# EAGLE design M4-RF (EAGLE 6.5.0)

## Sheet 1 of 4: 900MHz Radio
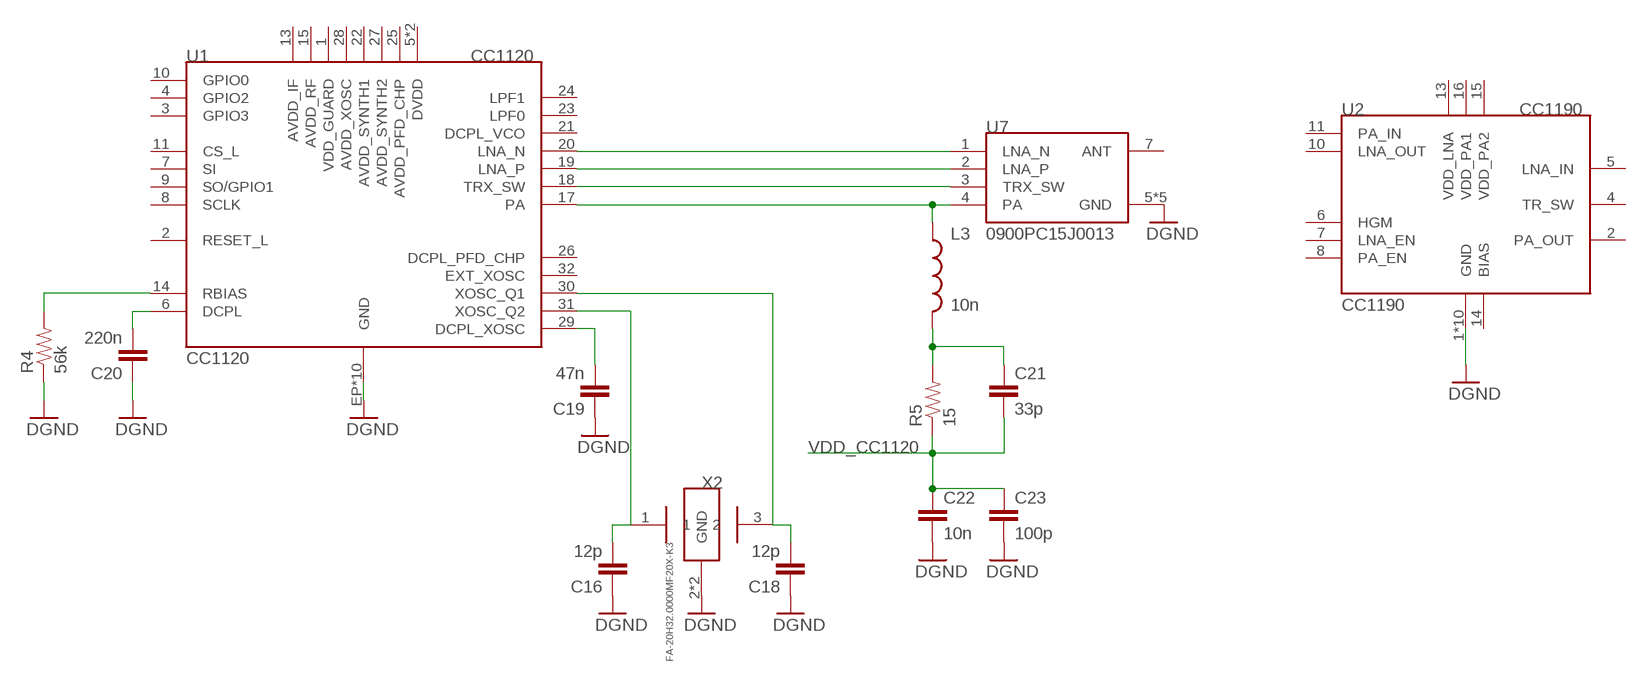
[diagram p0: schematic, sheet 1]

### Parts
C16  12p  CAP0402-CAP  [0402-CAP]
C18  12p  CAP0402-CAP  [0402-CAP]
C19  47n  CAP0402-CAP  [0402-CAP]
C20  220n  CAP0402-CAP  [0402-CAP]
C21  33p  CAP0402-CAP  [0402-CAP]
C22  10n  CAP0402-CAP  [0402-CAP]
C23  100p  CAP0402-CAP  [0402-CAP]
L3  10n  INDUCTOR0402  [C0402]
R4  56k  RESISTOR0402-RES  [0402-RES]
R5  15  RESISTOR0402-RES  [0402-RES]
U1  CC1120  [RHB_S-PVQFN-N32]
U2  CC1190  [RGV_S-PVQFN-N16]
U7  0900PC15J0013  [0900PC15J0013]
X2  FA-20H32.0000MF20X-K3  [FA-20H]

### Nets
GND: C16.1 C18.1 C19.1 C20.1 C22.2 C23.2 R4.1 U1.EP(GND) U1.EXP@1(GND) U1.EXP@2(GND) U1.EXP@3(GND) U1.EXP@4(GND) U1.EXP@5(GND) U1.EXP@6(GND) U1.EXP@7(GND) U1.EXP@8(GND) U1.EXP@9(GND) U2.1(GND) U2.3(GND) U2.9(GND) U2.12(GND) U2.EP(GND) U2.EP@1(GND) U2.EP@2(GND) U2.EP@3(GND) U2.EP@4(GND) U2.EP@5(GND) U7.5(GND) U7.6(GND) U7.8(GND) U7.9(GND) U7.10(GND) X2.2(GND) X2.4(GND) ; supply symbol labelled DGND ; also sheet 2
N$24: C16.2 U1.31(XOSC_Q2) X2.1
N$25: C18.2 U1.30(XOSC_Q1) X2.3
N$26: C19.2 U1.29(DCPL_XOSC)
N$27: C20.2 U1.6(DCPL)
N$28: R4.2 U1.14(RBIAS)
N$29: U1.20(LNA_N) U7.1(LNA_N)
N$30: U1.19(LNA_P) U7.2(LNA_P)
N$31: U1.18(TRX_SW) U7.3(TRX_SW)
N$32: L3.1 U1.17(PA) U7.4(PA)
N$33: C21.1 L3.2 R5.2
VDD_CC1120: C21.2 C22.1 C23.1 R5.1
Unconnected: U1.1(VDD_GUARD) U1.2(RESET_L) U1.3(GPIO3) U1.4(GPIO2) U1.5(DVDD) U1.7(SI) U1.8(SCLK) U1.9(SO/GPIO1) U1.10(GPIO0) U1.11(CS_L) U1.12(DVDD) U1.13(AVDD_IF) U1.15(AVDD_RF) U1.21(DCPL_VCO) U1.22(AVDD_SYNTH1) U1.23(LPF0) U1.24(LPF1) U1.25(AVDD_PFD_CHP) U1.26(DCPL_PFD_CHP) U1.27(AVDD_SYNTH2) U1.28(AVDD_XOSC) U1.32(EXT_XOSC) U2.2(PA_OUT) U2.4(TR_SW) U2.5(LNA_IN) U2.6(HGM) U2.7(LNA_EN) U2.8(PA_EN) U2.10(LNA_OUT) U2.11(PA_IN) U2.13(VDD_LNA) U2.14(BIAS) U2.15(VDD_PA2) U2.16(VDD_PA1) U7.7(ANT)

## Sheet 2 of 4: 2.4GHz Radio
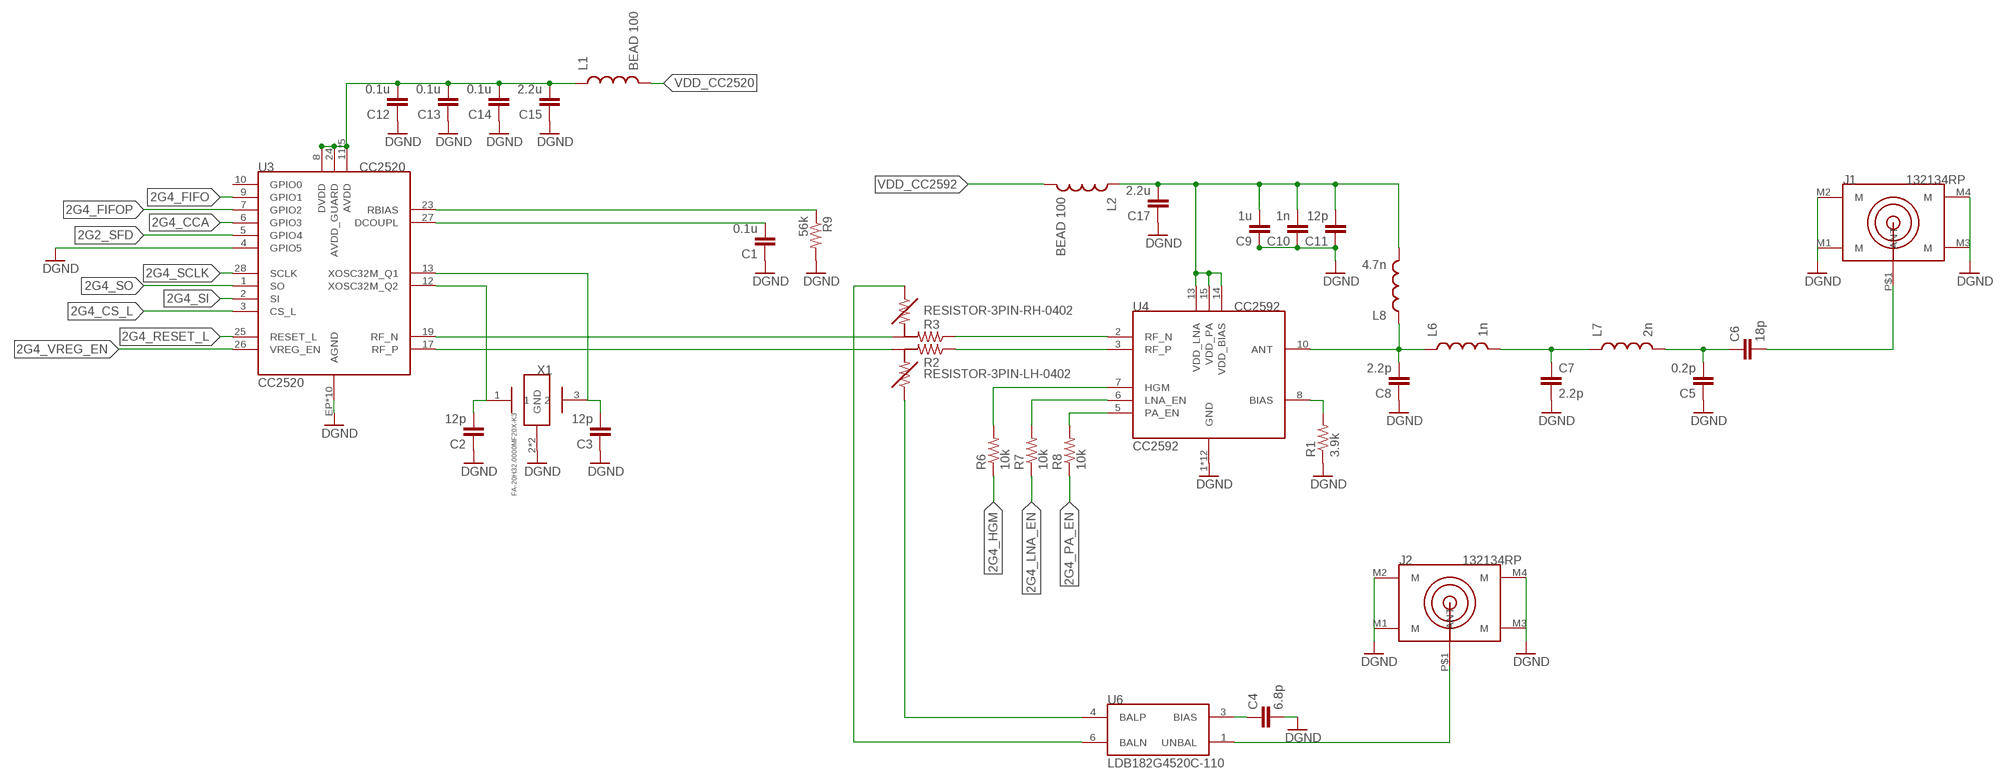
[diagram p1: schematic, sheet 2]

### Parts
C1  0.1u  CAP0402-CAP  [0402-CAP]
C2  12p  CAP0402-CAP  [0402-CAP]
C3  12p  CAP0402-CAP  [0402-CAP]
C4  6.8p  CAP0402-CAP  [0402-CAP]
C5  0.2p  CAP0402-CAP  [0402-CAP]
C6  18p  CAP0402-CAP  [0402-CAP]
C7  2.2p  CAP0402-CAP  [0402-CAP]
C8  2.2p  CAP0402-CAP  [0402-CAP]
C9  1u  CAP0402-CAP  [0402-CAP]
C10  1n  CAP0402-CAP  [0402-CAP]
C11  12p  CAP0402-CAP  [0402-CAP]
C12  0.1u  CAP0402-CAP  [0402-CAP]
C13  0.1u  CAP0402-CAP  [0402-CAP]
C14  0.1u  CAP0402-CAP  [0402-CAP]
C15  2.2u  CAP0402-CAP  [0402-CAP]
C17  2.2u  CAP0402-CAP  [0402-CAP]
J1  132134RP  [RP-SMA-TH]
J2  132134RP  [RP-SMA-TH]
L1  BEAD 100  INDUCTOR0402  [C0402]
L2  BEAD 100  INDUCTOR0402  [C0402]
L6  1n  INDUCTOR0402  [C0402]
L7  2n  INDUCTOR0402  [C0402]
L8  4.7n  INDUCTOR0402  [C0402]
R1  3.9k  RESISTOR0402-RES  [0402-RES]
R2  RESISTOR-3PIN-LH-0402  [0402-RES-3PIN-LH]
R3  RESISTOR-3PIN-RH-0402  [0402-RES-3PIN-RH]
R6  10k  RESISTOR0402-RES  [0402-RES]
R7  10k  RESISTOR0402-RES  [0402-RES]
R8  10k  RESISTOR0402-RES  [0402-RES]
R9  56k  RESISTOR0402-RES  [0402-RES]
U3  CC2520  [RHD_S-PVQFN-N28]
U4  CC2592  [RGV_S-PVQFN-N16]
U6  LDB182G4520C-110  [LDB18]
X1  FA-20H32.0000MF20X-K3  [FA-20H]

### Nets
2G2_SFD: U3.5(GPIO4)
2G4_CCA: U3.6(GPIO3)
2G4_CS_L: U3.3(CS_L)
2G4_FIFO: U3.9(GPIO1)
2G4_FIFOP: U3.7(GPIO2)
2G4_HGM: R6.1
2G4_LG [50 ohm]: C6.2 J1.P$1(ANT)
2G4_LNA_EN: R7.1
2G4_LP [50 ohm]: J2.P$1(ANT) U6.1(UNBAL)
2G4_PA_EN: R8.1
2G4_RESET_L: U3.25(RESET_L)
2G4_SCLK: U3.28(SCLK)
2G4_SI: U3.2(SI)
2G4_SO: U3.1(SO)
2G4_VREG_EN: U3.26(VREG_EN)
GND: C1.1 C2.1 C3.1 C4.2 C5.1 C7.2 C8.1 C9.1 C10.1 C11.1 C12.1 C13.1 C14.1 C15.1 C17.1 J1.M1(M) J1.M2(M) J1.M3(M) J1.M4(M) J2.M1(M) J2.M2(M) J2.M3(M) J2.M4(M) R1.1 R9.2 U3.4(GPIO5) U3.EP(AGND) U3.EXP@1(AGND) U3.EXP@2(AGND) U3.EXP@3(AGND) U3.EXP@4(AGND) U3.EXP@5(AGND) U3.EXP@6(AGND) U3.EXP@7(AGND) U3.EXP@8(AGND) U3.EXP@9(AGND) U4.1(GND) U4.4(GND) U4.9(GND) U4.11(GND) U4.12(GND) U4.16(GND) U4.EP(GND) U4.EP@1(GND) U4.EP@2(GND) U4.EP@3(GND) U4.EP@4(GND) U4.EP@5(GND) X1.2(GND) X1.4(GND) ; supply symbol labelled DGND ; also sheet 1
N$1 [50 ohm]: R3.2 U3.19(RF_N)
N$2 [50 ohm]: R2.2 U3.17(RF_P)
N$3: R6.2 U4.7(HGM)
N$5: R7.2 U4.6(LNA_EN)
N$6 [50 ohm]: R2.1 U4.3(RF_P)
N$7 [50 ohm]: C8.2 L6.1 L8.1 U4.10(ANT)
N$8 [50 ohm]: C7.1 L6.2 L7.1
N$9 [50 ohm]: C5.2 C6.1 L7.2
N$10: C9.2 C10.2 C11.2 C17.2 L2.1 L8.2 U4.13(VDD_LNA) U4.14(VDD_BIAS) U4.15(VDD_PA)
N$11: R1.2 U4.8(BIAS)
N$12 [50 ohm]: R3.1 U4.2(RF_N)
N$13: R8.2 U4.5(PA_EN)
N$14: C12.2 C13.2 C14.2 C15.2 L1.1 U3.8(DVDD) U3.11(AVDD) U3.14(AVDD) U3.16(AVDD) U3.20(AVDD) U3.22(AVDD) U3.24(AVDD_GUARD)
N$15: C2.2 U3.12(XOSC32M_Q2) X1.1
N$16: R9.1 U3.23(RBIAS)
N$17: C1.2 U3.27(DCOUPL)
N$18: C3.2 U3.13(XOSC32M_Q1) X1.3
N$19 [50 ohm]: R2.3 U6.4(BALP)
N$20 [50 ohm]: R3.3 U6.6(BALN)
N$22: C4.1 U6.3(BIAS)
VDD_CC2520: L1.2
VDD_CC2592: L2.2
Unconnected: U3.10(GPIO0)

## Sheet 3 of 4: MCU
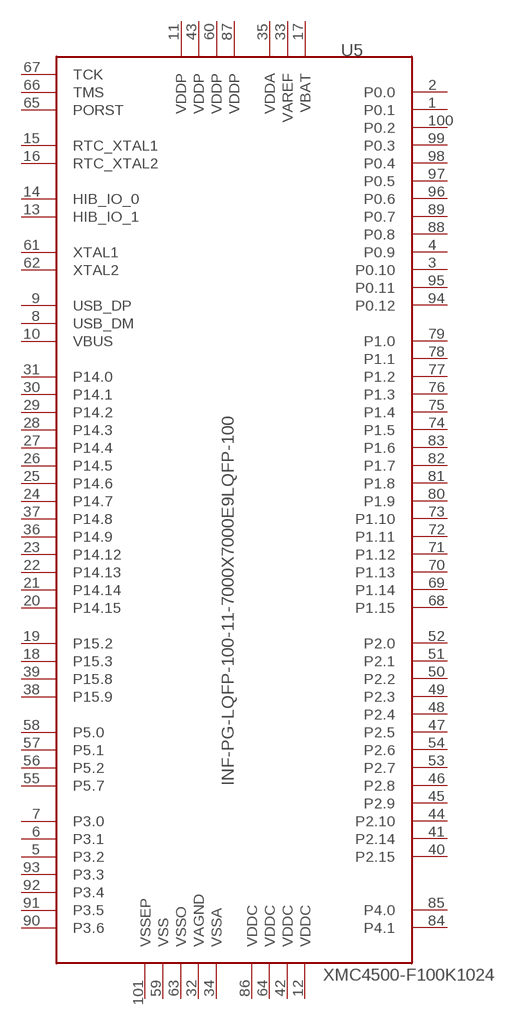
[diagram p2: schematic, sheet 3]

### Parts
U5  INF-PG-LQFP-100-11-7000X7000E9LQFP-100  [INF-PG-LQFP-100-11-7000X7000E9PRIMARY]
Unconnected: U5.1(P0.1) U5.2(P0.0) U5.3(P0.10) U5.4(P0.9) U5.5(P3.2) U5.6(P3.1) U5.7(P3.0) U5.8(USB_DM) U5.9(USB_DP) U5.10(VBUS) U5.11(VDDP) U5.12(VDDC) U5.13(HIB_IO_1) U5.14(HIB_IO_0) U5.15(RTC_XTAL1) U5.16(RTC_XTAL2) U5.17(VBAT) U5.18(P15.3) U5.19(P15.2) U5.20(P14.15) U5.21(P14.14) U5.22(P14.13) U5.23(P14.12) U5.24(P14.7) U5.25(P14.6) U5.26(P14.5) U5.27(P14.4) U5.28(P14.3) U5.29(P14.2) U5.30(P14.1) U5.31(P14.0) U5.32(VAGND) U5.33(VAREF) U5.34(VSSA) U5.35(VDDA) U5.36(P14.9) U5.37(P14.8) U5.38(P15.9) U5.39(P15.8) U5.40(P2.15) U5.41(P2.14) U5.42(VDDC) U5.43(VDDP) U5.44(P2.10) U5.45(P2.9) U5.46(P2.8) U5.47(P2.5) U5.48(P2.4) U5.49(P2.3) U5.50(P2.2) U5.51(P2.1) U5.52(P2.0) U5.53(P2.7) U5.54(P2.6) U5.55(P5.7) U5.56(P5.2) U5.57(P5.1) U5.58(P5.0) U5.59(VSS) U5.60(VDDP) U5.61(XTAL1) U5.62(XTAL2) U5.63(VSSO) U5.64(VDDC) U5.65(PORST) U5.66(TMS) U5.67(TCK) U5.68(P1.15) U5.69(P1.14) U5.70(P1.13) U5.71(P1.12) U5.72(P1.11) U5.73(P1.10) U5.74(P1.5) U5.75(P1.4) U5.76(P1.3) U5.77(P1.2) U5.78(P1.1) U5.79(P1.0) U5.80(P1.9) U5.81(P1.8) U5.82(P1.7) U5.83(P1.6) U5.84(P4.1) U5.85(P4.0) U5.86(VDDC) U5.87(VDDP) U5.88(P0.8) U5.89(P0.7) U5.90(P3.6) U5.91(P3.5) U5.92(P3.4) U5.93(P3.3) U5.94(P0.12) U5.95(P0.11) U5.96(P0.6) U5.97(P0.5) U5.98(P0.4) U5.99(P0.3) U5.100(P0.2) U5.101(VSSEP)

## Sheet 4 of 4: USB Interface

## Library data of the parts
C1-C20 = SparkFun-Capacitors:CAP: Capacitor Standard 0603 ceramic capacitor, and 0.1" leaded capacitor.
C21-C23 = SparkFun-Passives:CAP: Capacitor Standard 0603 ceramic capacitor, and 0.1" leaded capacitor.
J1 J2 = connectors:132134RP
L1-L3 L6-L8 = SparkFun-Passives:INDUCTOR: Inductors Basic Inductor/Choke - 0603 and 1206. Footprints are not proven and vary greatly between part numbers.
R1 R4-R9 = SparkFun-Resistors:RESISTOR: Resistor Basic schematic elements and footprints for 0603, 1206, and PTH resistors.
R2 = SparkFun-Resistors:RESISTOR-3PIN-LH
R3 = SparkFun-Resistors:RESISTOR-3PIN-RH
U1 = rf:CC1120
U2 = rf:CC1190
U3 = rf:CC2520
U4 = rf:CC2592
U5 = XMC4500-F100K1024 AB:INF-PG-LQFP-100-11-7000X7000E9
U6 = rf:LDB18
U7 = rf:0900PC15J0013
X1 X2 = oscillators:FA-20H

## Net classes
1 50 ohm: width 0.305 mm

## Board
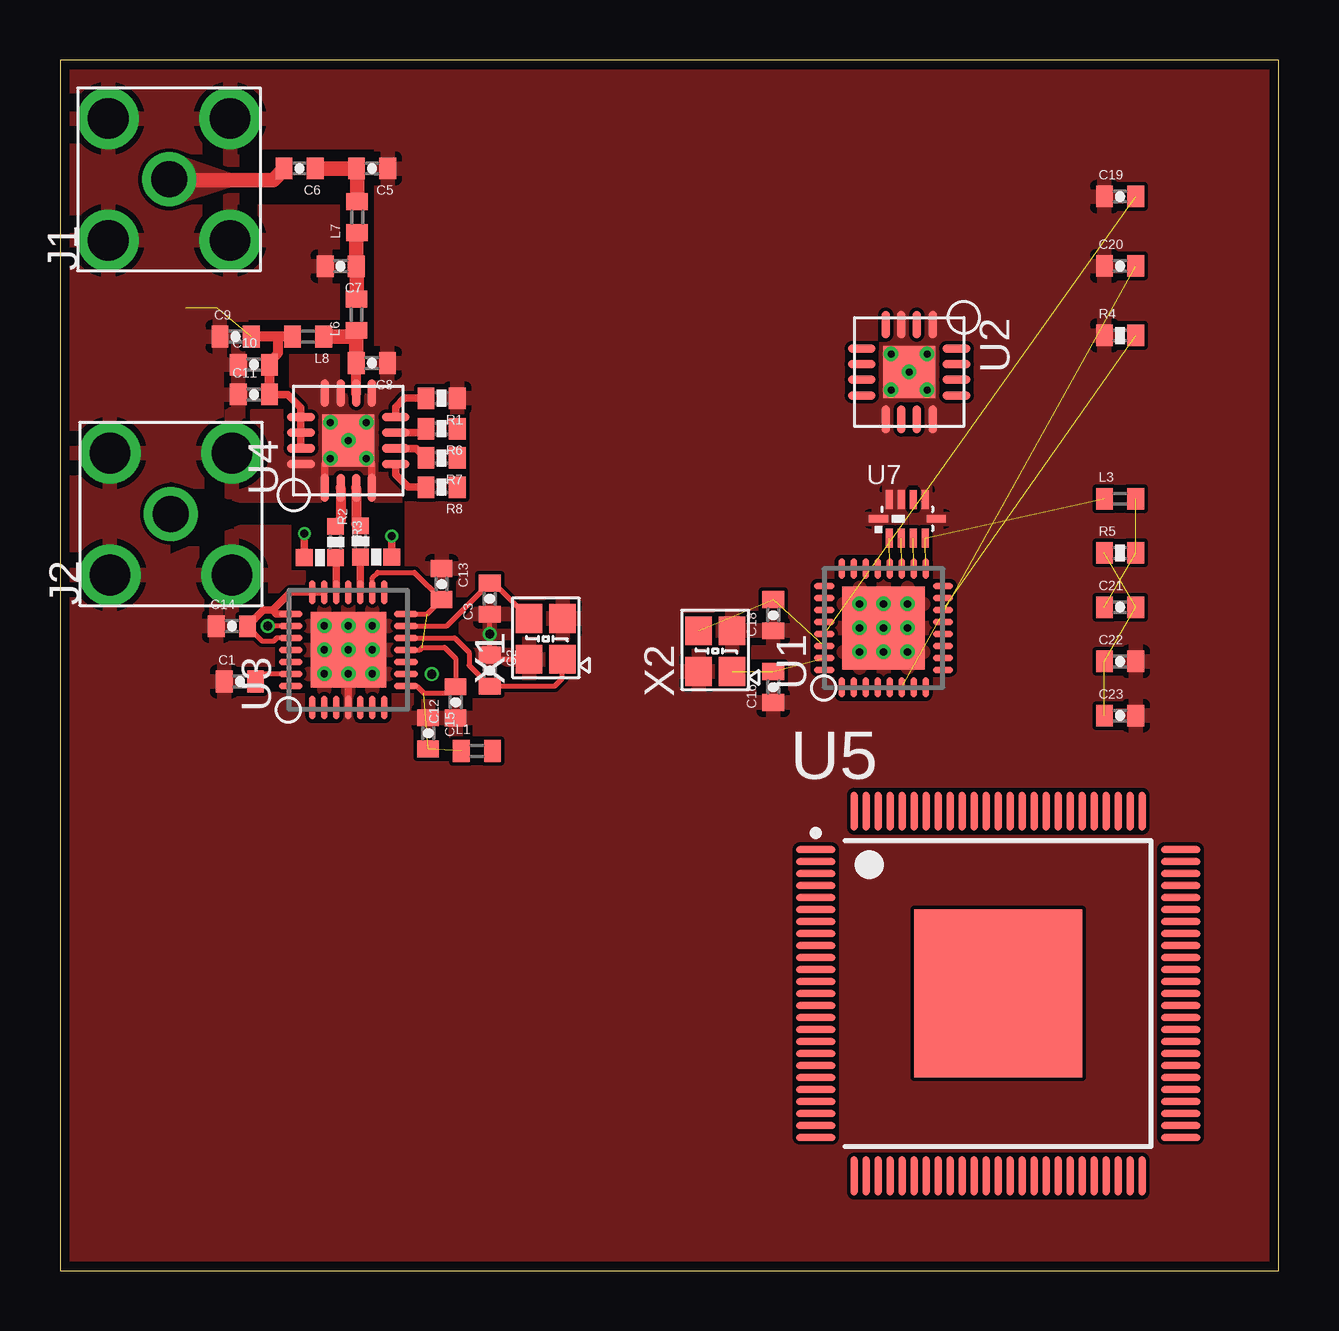
[diagram p3: board, top side]
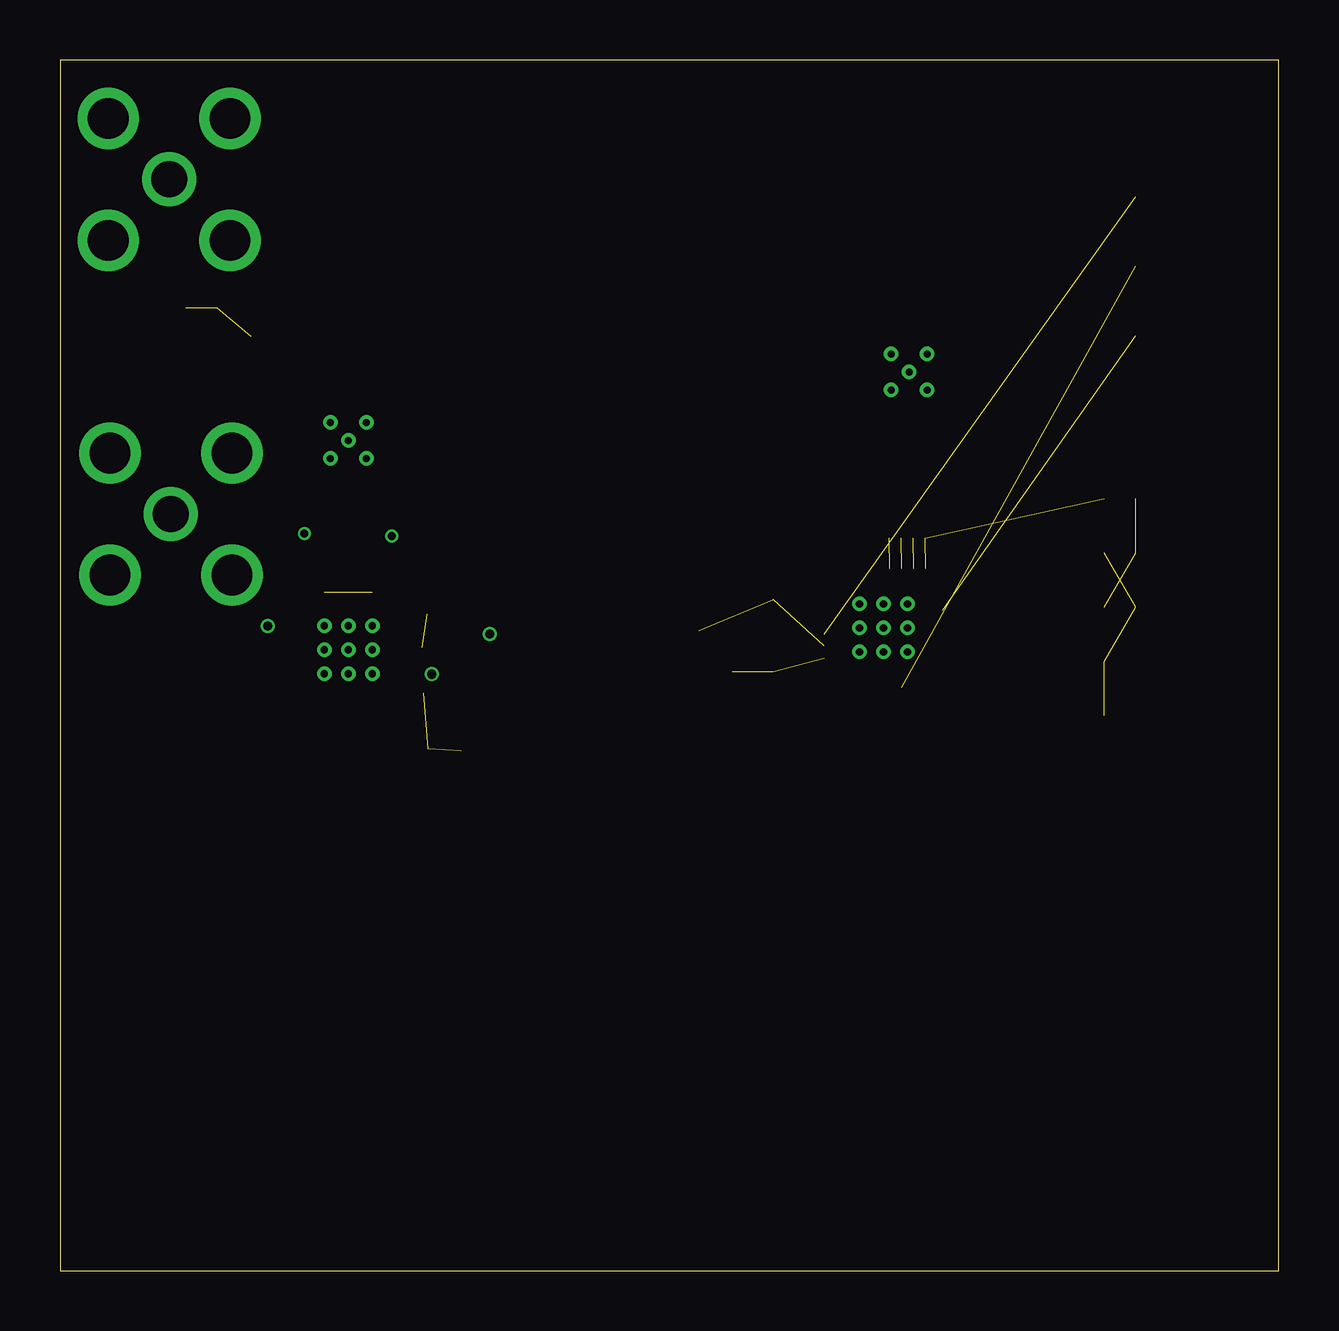
[diagram p4: board, inner layer Route2]
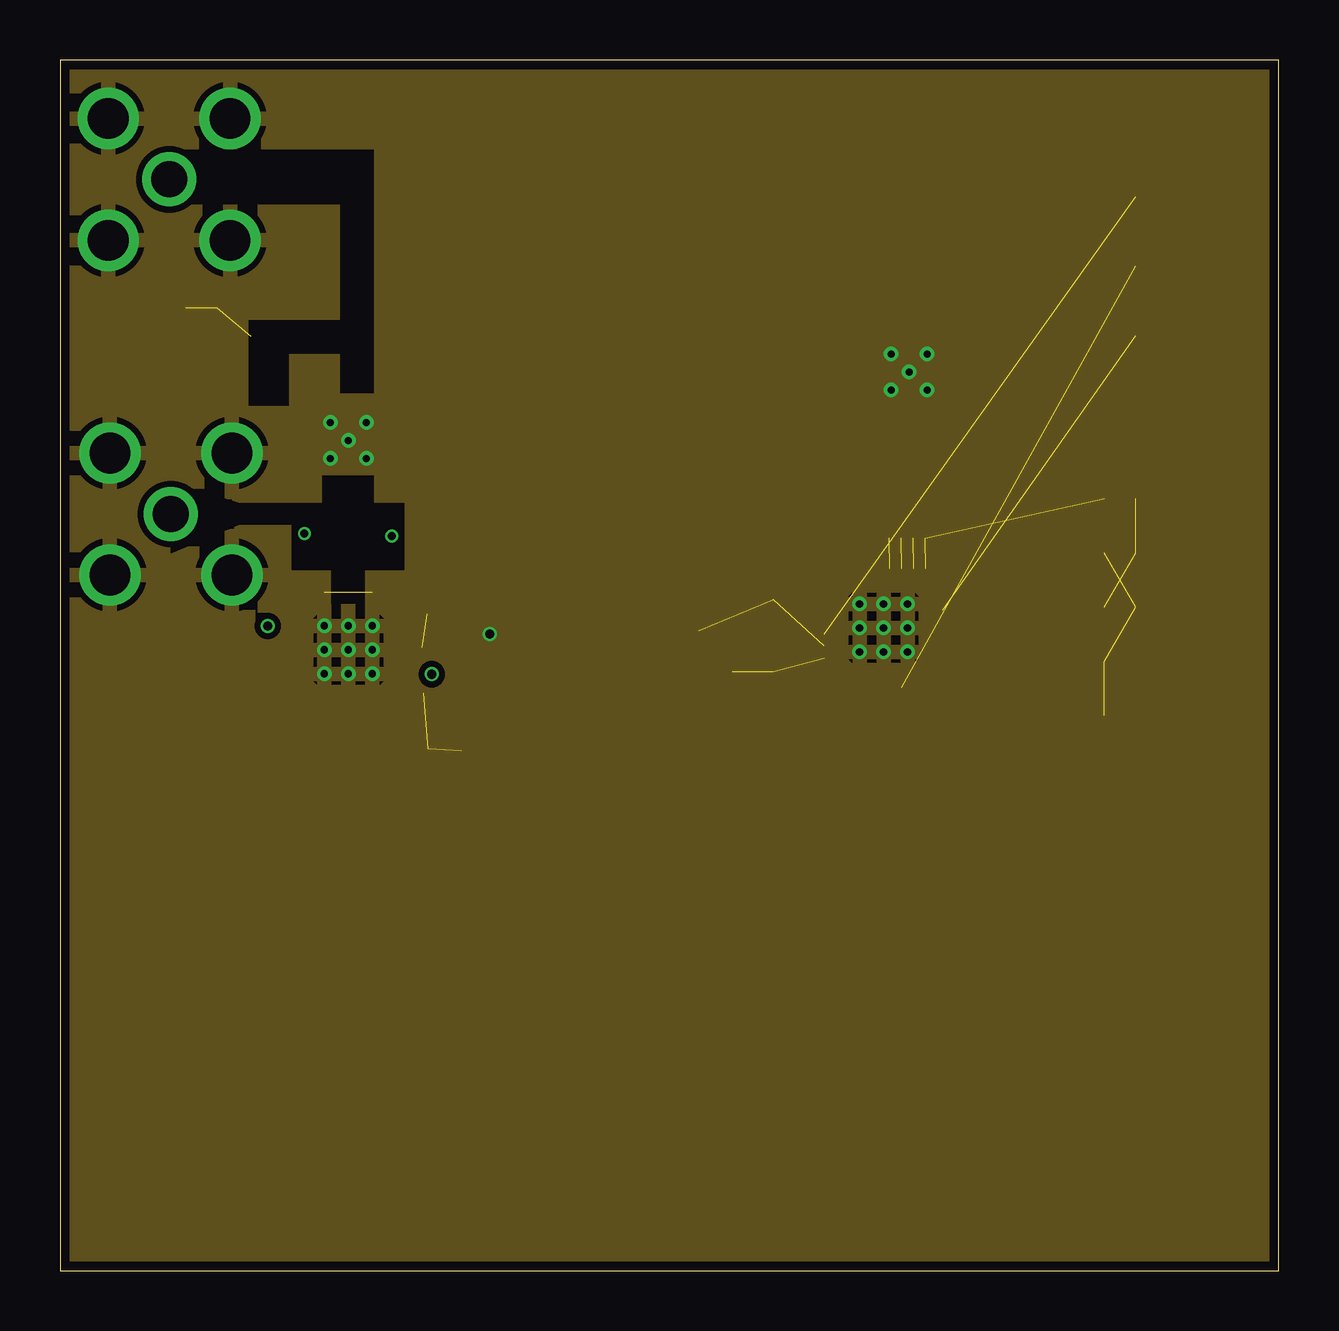
[diagram p5: board, inner layer Route15]
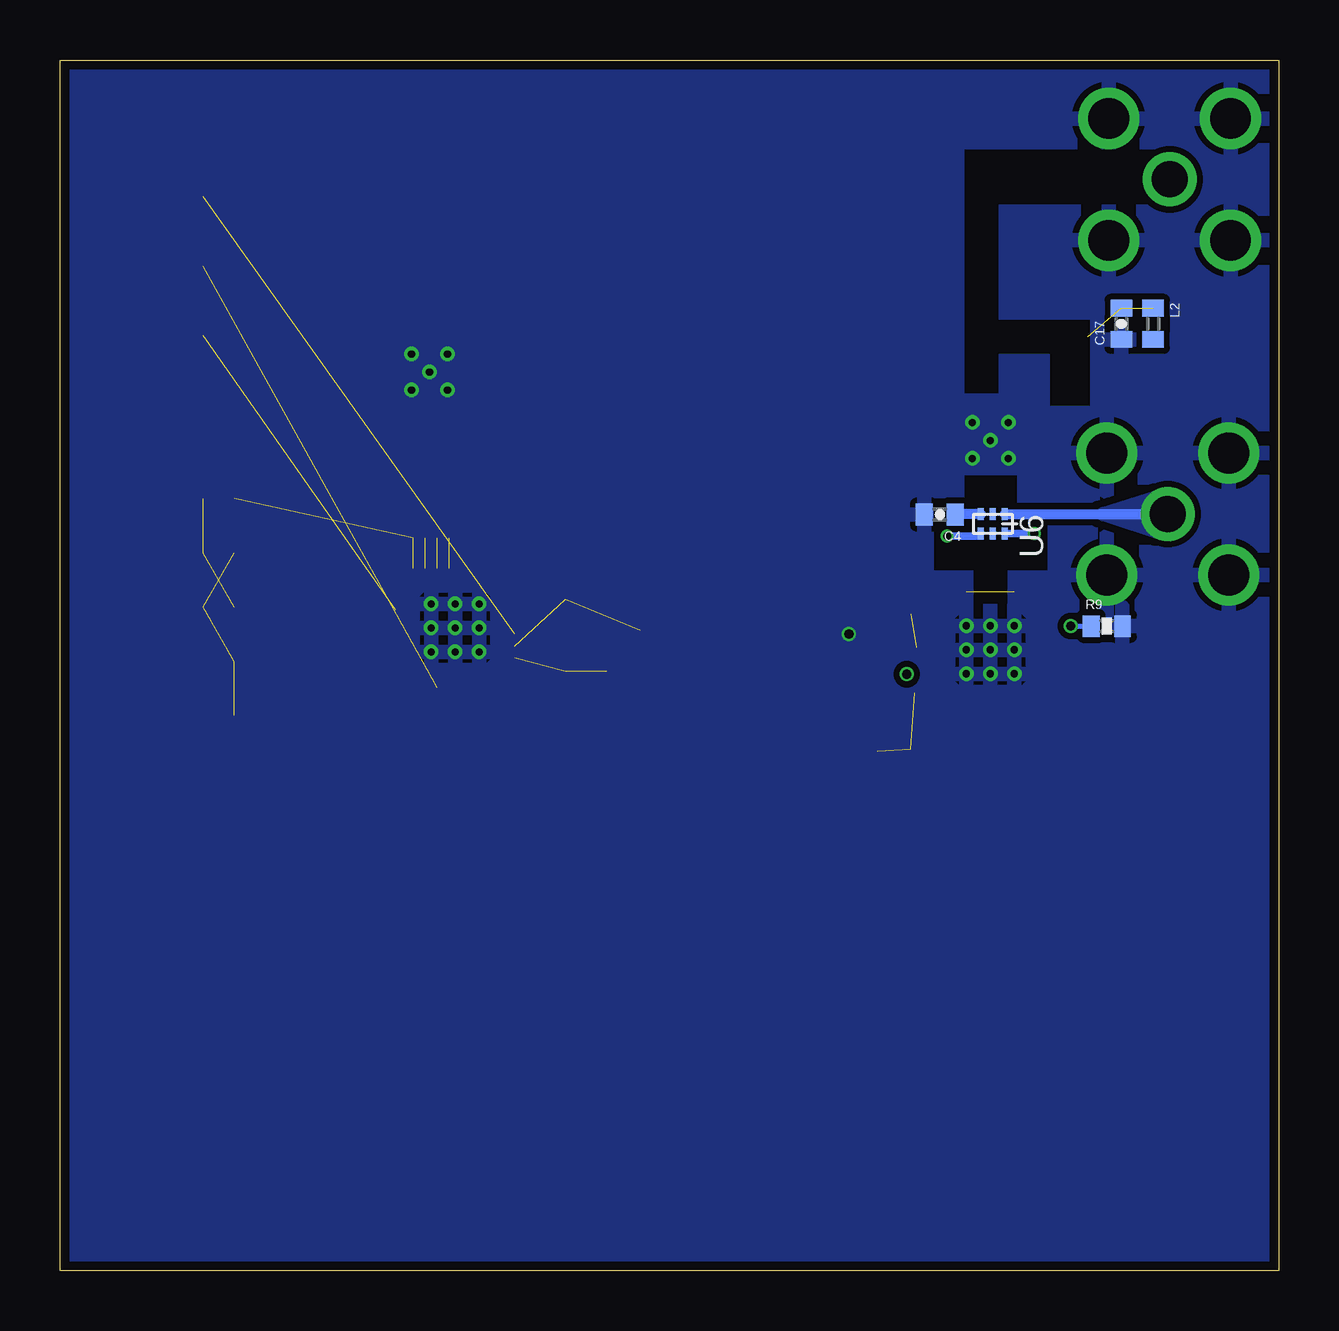
[diagram p6: board, bottom side, seen from below]

Size 50.78 x 50.47 mm. Coordinates in mm from the lower left corner, seen from the top.
Outline: 0,0 50.78,0 50.78,50.47 0,50.47 0,0
Copper layers (1*2*15*16): Top 0.035559375mm / dielectric 0.17018125mm / Route2 0.01778125mm / dielectric 47mil / Route15 0.01778125mm / dielectric 0.17018125mm / Bottom 0.035559375mm
Design rules "OSHPark-4layer *": minimum track width 5mil, minimum drill 10mil, track to track 6mil, track to pad 6mil, pad to pad 6mil, via to via 6mil, smd to smd 6mil, copper to edge 15mil, drill to drill 6mil, minimum pad ring 4mil, minimum via ring 4mil, stop-mask expansion 4mil, vias tented up to drill 0mil, thermal gap 10mil

### Footprints (pad centres in the part's own frame; a part is rotated, then mirrored left to right if it is on the bottom)
0402-CAP = smd 0.7 x 0.9: 1 -0.65,0; 2 0.65,0
RP-SMA-TH = drill 1.7: M1 -2.54,2.54; M2 2.54,2.54; M3 2.54,-2.54; M4 -2.54,-2.54 | drill 1.5: P$1 0,0
C0402 = smd 0.7 x 0.9: 1 -0.65,0; 2 0.65,0
0402-RES = smd 0.7 x 0.9: 1 -0.65,0; 2 0.65,0
0402-RES-3PIN-LH = smd 0.7 x 0.7: 1 -0.65,0; 2 0.65,0; 3 0.65,1.3
0402-RES-3PIN-RH = smd 0.7 x 0.7: 1 -0.65,0; 2 0.65,0; 3 0.65,-1.3
RHB_S-PVQFN-N32 = smd 0.85 x 0.28: 1 -2.475,1.75; 2 -2.475,1.25; 3 -2.475,0.75; 4 -2.475,0.25; 5 -2.475,-0.25; 6 -2.475,-0.75; 7 -2.475,-1.25; 8 -2.475,-1.75; 17 2.475,-1.75; 18 2.475,-1.25; 19 2.475,-0.75; 20 2.475,-0.25; 21 2.475,0.25; 22 2.475,0.75; 23 2.475,1.25; 24 2.475,1.75 | smd 0.28 x 0.85: 9 -1.75,-2.475; 10 -1.25,-2.475; 11 -0.75,-2.475; 12 -0.25,-2.475; 13 0.25,-2.475; 14 0.75,-2.475; 15 1.25,-2.475; 16 1.75,-2.475; 25 1.75,2.475; 26 1.25,2.475; 27 0.75,2.475; 28 0.25,2.475; 29 -0.25,2.475; 30 -0.75,2.475; 31 -1.25,2.475; 32 -1.75,2.475 | smd 3.45 x 3.45: EP 0,0 | drill 0.3 pad 0.6: EXP@1 -1,1; EXP@2 0,1; EXP@3 1,1; EXP@4 -1,0; EXP@5 0,0; EXP@6 1,0; EXP@7 -1,-1; EXP@8 0,-1; EXP@9 1,-1
RGV_S-PVQFN-N16 = smd 1.15 x 0.35: 1 -1.975,0.975; 2 -1.975,0.325; 3 -1.975,-0.325; 4 -1.975,-0.975; 9 1.975,-0.975; 10 1.975,-0.325; 11 1.975,0.325; 12 1.975,0.975 | smd 0.35 x 1.15: 5 -0.975,-1.975; 6 -0.325,-1.975; 7 0.325,-1.975; 8 0.975,-1.975; 13 0.975,1.975; 14 0.325,1.975; 15 -0.325,1.975; 16 -0.975,1.975 | smd 2.16 x 2.16: EP 0,0 | drill 0.3 pad 0.6: EP@1 0.75,0.75; EP@2 0.75,-0.75; EP@3 -0.75,-0.75; EP@4 -0.75,0.75; EP@5 0,0
RHD_S-PVQFN-N28 = smd 1 x 0.28: 1 -2.4,1.5; 2 -2.4,1; 3 -2.4,0.5; 4 -2.4,0; 5 -2.4,-0.5; 6 -2.4,-1; 7 -2.4,-1.5; 15 2.4,-1.5; 16 2.4,-1; 17 2.4,-0.5; 18 2.4,0; 19 2.4,0.5; 20 2.4,1; 21 2.4,1.5 | smd 0.28 x 1: 8 -1.5,-2.4; 9 -1,-2.4; 10 -0.5,-2.4; 11 0,-2.4; 12 0.5,-2.4; 13 1,-2.4; 14 1.5,-2.4; 22 1.5,2.4; 23 1,2.4; 24 0.5,2.4; 25 0,2.4; 26 -0.5,2.4; 27 -1,2.4; 28 -1.5,2.4 | smd 3.15 x 3.15: EP 0,0 | drill 0.3 pad 0.6: EXP@1 -1,1; EXP@2 0,1; EXP@3 1,1; EXP@4 -1,0; EXP@5 0,0; EXP@6 1,0; EXP@7 -1,-1; EXP@8 0,-1; EXP@9 1,-1
INF-PG-LQFP-100-11-7000X7000E9PRIMARY = smd 1.65 x 0.3: 1 -7.6,6; 2 -7.6,5.5; 3 -7.6,5; 4 -7.6,4.5; 5 -7.6,4; 6 -7.6,3.5; 7 -7.6,3; 8 -7.6,2.5; 9 -7.6,2; 10 -7.6,1.5; 11 -7.6,1; 12 -7.6,0.5; 13 -7.6,0; 14 -7.6,-0.5; 15 -7.6,-1; 16 -7.6,-1.5; 17 -7.6,-2; 18 -7.6,-2.5; 19 -7.6,-3; 20 -7.6,-3.5; 21 -7.6,-4; 22 -7.6,-4.5; 23 -7.6,-5; 24 -7.6,-5.5; 25 -7.6,-6; 51 7.6,-6; 52 7.6,-5.5; 53 7.6,-5; 54 7.6,-4.5; 55 7.6,-4; 56 7.6,-3.5; 57 7.6,-3; 58 7.6,-2.5; 59 7.6,-2; 60 7.6,-1.5; 61 7.6,-1; 62 7.6,-0.5; 63 7.6,0; 64 7.6,0.5; 65 7.6,1; 66 7.6,1.5; 67 7.6,2; 68 7.6,2.5; 69 7.6,3; 70 7.6,3.5; 71 7.6,4; 72 7.6,4.5; 73 7.6,5; 74 7.6,5.5; 75 7.6,6 | smd 0.3 x 1.65: 26 -6,-7.6; 27 -5.5,-7.6; 28 -5,-7.6; 29 -4.5,-7.6; 30 -4,-7.6; 31 -3.5,-7.6; 32 -3,-7.6; 33 -2.5,-7.6; 34 -2,-7.6; 35 -1.5,-7.6; 36 -1,-7.6; 37 -0.5,-7.6; 38 0,-7.6; 39 0.5,-7.6; 40 1,-7.6; 41 1.5,-7.6; 42 2,-7.6; 43 2.5,-7.6; 44 3,-7.6; 45 3.5,-7.6; 46 4,-7.6; 47 4.5,-7.6; 48 5,-7.6; 49 5.5,-7.6; 50 6,-7.6; 76 6,7.6; 77 5.5,7.6; 78 5,7.6; 79 4.5,7.6; 80 4,7.6; 81 3.5,7.6; 82 3,7.6; 83 2.5,7.6; 84 2,7.6; 85 1.5,7.6; 86 1,7.6; 87 0.5,7.6; 88 0,7.6; 89 -0.5,7.6; 90 -1,7.6; 91 -1.5,7.6; 92 -2,7.6; 93 -2.5,7.6; 94 -3,7.6; 95 -3.5,7.6; 96 -4,7.6; 97 -4.5,7.6; 98 -5,7.6; 99 -5.5,7.6; 100 -6,7.6 | smd 7 x 7: 101 0,0
LDB18 = smd 0.5 x 0.25: 1 -0.4,0.5; 2 -0.4,0; 3 -0.4,-0.5; 4 0.4,-0.5; 5 0.4,0; 6 0.4,0.5
0900PC15J0013 = smd 0.3 x 0.8: 1 -0.75,-0.8; 2 -0.25,-0.8; 3 0.25,-0.8; 4 0.75,-0.8; 6 0.75,0.8; 7 0.25,0.8; 8 -0.25,0.8; 9 -0.75,0.8 | smd 0.8 x 0.3: 5 1.2,0; 10 -1.2,0
FA-20H = smd 1.2 x 1.1: 1 -0.85,-0.7; 2 0.85,-0.7; 3 0.85,0.7; 4 -0.85,0.7

### Placement (x,y rotation side)
C1  7.49,24.56 0 top
C2  17.91,25.02 270 top
C3  17.91,28.02 90 top
C4  14.12,31.52 180 bottom
C5  13,45.95 180 top
C6  9.98,45.95 180 top
C7  11.7,41.87 180 top
C8  12.99,37.83 180 top
C9  7.32,38.94 0 top
C10  8.08,37.77 0 top
C11  8.08,36.53 0 top
C12  16.48,23.7 90 top
C13  15.9,28.63 270 top
C14  7.16,26.87 0 top
C15  15.34,22.4 270 top
C16  29.72,24.33 90 top
C17  6.55,39.47 90 bottom
C18  29.72,27.33 90 top
C19  44.17,44.78 0 top
C20  44.17,41.88 0 top
C21  44.17,27.66 0 top
C22  44.17,25.4 0 top
C23  44.17,23.14 0 top
J1  4.55,45.49 90 top
J2  4.62,31.55 90 top
L1  17.37,21.67 0 top
L2  5.23,39.47 270 bottom
L3  44.17,32.18 0 top
L6  12.36,39.85 90 top
L7  12.38,43.92 90 top
L8  10.34,38.94 180 top
R1  15.9,36.37 180 top
R2  12.52,30.4 270 top
R3  11.48,30.38 270 top
R4  44.17,38.99 0 top
R5  44.17,29.92 0 top
R6  15.9,35.1 180 top
R7  15.9,33.88 180 top
R8  15.9,32.66 180 top
R9  7.16,26.87 0 bottom
U1  34.32,26.8 90 top
U2  35.38,37.47 270 top
U3  12.01,25.88 90 top
U4  12.01,34.61 90 top
U5  39.09,11.56 0 top
U6  11.91,31.14 270 bottom
U7  35.31,31.34 0 top
X1  20.24,26.34 90 top
X2  27.3,25.83 90 top

### Tracks (layer width: path | path; a pad name or v marks a point on that pad's centre or on a via)
2G4_LG
  Top 0.61: C6.2 9.33,45.91 8.89,45.47 4.57,45.47 J1.P$1
  pour Top (no thermals): 7.11,45.47 4.57,46.33 4.57,44.65
2G4_LP
  Bottom 0.406: U6.1 J2.P$1
  pour Bottom (isolate 0.635, no thermals): 7.32,31.55 4.72,32.36 4.72,30.68
GND  (via drill 0.38)
  Top 0.203: C3.1 v17.91,26.54 C2.1 18.09,25.49 X1.4
  Top 0.305: U4.1 11.04,33.63 U4.EP@4 | U4.4 12.99,33.63 U4.EP@3 | U3.4 U3.EXP@4
  pour Bottom (isolate 0.254, rank 6): 0,0 0,54.1 50.8,54.1 50.8,0
  pour Top (isolate 0.127, rank 6): 0,-3.05 0,50.55 50.8,50.55 50.8,-3.05
  pour Route15 (isolate 0.254, rank 6): 0,0 0,50.55 56.39,50.55 56.39,0
N$1
  Top 0.305: U3.19 11.51,29.7 R3.2
N$2
  Top 0.305: U3.17 R2.2
N$3
  Top 0.305: U4.7 15.08,34.93 R6.2
N$4
  cutout Top (rank 3): 12.83,32 7.49,32 4.57,32.89 4.62,29.9 7.49,31.11 12.83,31.11
  cutout Route15 (rank 3): 11.3,32 7.49,32 4.57,32.89 4.62,29.9 7.49,31.11 11.3,31.11
  cutout Route2 (rank 3): 11.3,32 7.49,32 4.57,32.89 4.62,29.9 7.49,31.11 11.3,31.11
  cutout Bottom (rank 3): 12.83,32 7.72,32 7.72,31.11 9.55,31.11 12.83,31.11
N$5
  Top 0.305: U4.6 14.85,34.28 R7.2
N$6
  Top 0.406: U4.3 12.34,31.14 R2.1
N$7
  Top 0.406: U4.10 C8.2
  Top 0.61: C8.2 12.34,39.19 L6.1 12.09,38.94 L8.1
N$8
  Top 0.61: L6.2 C7.1 12.35,43.23 L7.1
N$9
  Top 0.61: L7.2 12.38,45.92 C5.2 C6.1
N$10  (2 unrouted)
  Top 0.305: U4.15 U4.14 U4.13 10.04,35.99 9.5,36.52 C11.2
  Top 0.406: L8.2 9.09,38.94 | 9.09,38.94 C9.2 | C11.2 C10.2 8.73,37.89 9.09,38.25 9.09,38.94
N$11
  Top 0.305: U4.8 13.99,36.01 14.35,36.37 R1.2
N$12
  Top 0.406: U4.2 11.69,31.24 R3.1
N$13
  Top 0.305: U4.5 13.99,33.18 14.5,32.66 R8.2
N$14  (4 unrouted)
  Top 0.203: U3.8 14.86,24.38 15.16,24.08 16.22,24.08 C12.2 16.48,25.53 16.03,25.98 15.09,25.98 14.99,25.88 U3.11 | U3.14 15.31,27.38 C13.2 14.77,29.11 13.23,29.11 13.01,28.89 U3.16 | U3.24 9.03,26.38 8.89,26.24 8.45,26.24 C14.2
  Top 0.305: U3.22 9.02,27.38 8.87,27.53 | 8.87,27.53 8.47,27.53 C14.2 | 8.87,27.53 9.61,28.28 U3.20
N$15
  Top 0.203: U3.12 16.44,26.38 17.04,25.78 17.04,25.23 C2.2 20.61,24.37 20.93,24.69 20.93,25.48 X1.1
N$16  (via drill 0.38)
  Top 0.203: U3.23 8.77,26.88 v8.66,26.87
  Bottom 0.203: v8.66,26.87 R9.1
N$17
  Top 0.203: U3.27 8.46,24.88 C1.2
N$18
  Top 0.203: U3.13 16.12,26.88 C3.2 18.07,28.67 X1.3
N$19  (via drill 0.33)
  Top 0.305: R2.3 13.82,30.58 v13.82,30.63
  Bottom 0.305: v13.82,30.63 12.57,30.63 U6.4
N$20  (via drill 0.33)
  Top 0.305: R3.3 v10.18,30.73 v10.19,30.73
  Bottom 0.305: v10.19,30.73 U6.6
N$21
  cutout Top (rank 3): 10.92,33.15 10.92,32 9.65,32 9.65,29.21 11.05,29.21 11.3,29.21 11.3,27.81 12.7,27.81 12.7,29.21 14.35,29.21 14.35,32 13.08,32 13.08,33.15
  cutout Bottom (rank 3): 10.92,33.15 10.92,32 9.65,32 9.65,29.21 11.05,29.21 11.3,29.21 11.3,27.81 12.7,27.81 12.7,29.21 14.35,29.21 14.35,32 13.08,32 13.08,33.15
  cutout Route15 (rank 3): 10.92,33.15 10.92,32 9.65,32 9.65,29.21 11.05,29.21 11.3,29.21 11.3,27.81 12.7,27.81 12.7,29.21 14.35,29.21 14.35,32 13.08,32 13.08,33.15
  cutout Route2 (rank 3): 10.92,33.15 10.92,32 9.65,32 9.65,29.21 11.05,29.21 11.3,29.21 11.3,27.81 12.7,27.81 12.7,29.21 14.35,29.21 14.35,32 13.08,32 13.08,33.15
N$22
  Bottom 0.406: U6.3 13.45,31.54 C4.1
N$23  (via drill 0.38)
  other vias: 15.49,24.87
N$24  (2 unrouted)
N$25  (2 unrouted)
N$26  (1 unrouted)
N$27  (1 unrouted)
N$28  (1 unrouted)
N$29  (1 unrouted)
N$30  (1 unrouted)
N$31  (1 unrouted)
N$32  (2 unrouted)
N$33  (2 unrouted)
RFCUTOUT1
  cutout Top: 13.08,36.58 13.08,46.74 7.49,46.74 7.49,44.45 11.68,44.45 11.68,39.62 7.87,39.62 7.87,36.07 9.53,36.07 9.53,38.23 11.68,38.23 11.68,36.58
  cutout Bottom: 13.08,36.58 13.08,46.74 5.33,46.74 5.33,44.45 11.68,44.45 11.68,39.62 7.87,39.62 7.87,36.07 9.53,36.07 9.53,38.23 11.68,38.23 11.68,36.58
  cutout Route2: 13.08,36.58 13.08,46.74 5.33,46.74 5.33,44.45 11.68,44.45 11.68,39.62 7.87,39.62 7.87,36.07 9.53,36.07 9.53,38.23 11.68,38.23 11.68,36.58
  cutout Route15: 13.08,36.58 13.08,46.74 5.33,46.74 5.33,44.45 11.68,44.45 11.68,39.62 7.87,39.62 7.87,36.07 9.53,36.07 9.53,38.23 11.68,38.23 11.68,36.58
VDD_CC1120  (3 unrouted)